# EAGLE design BB-Powersupply+KNX-Connection (EAGLE 9.6.2)
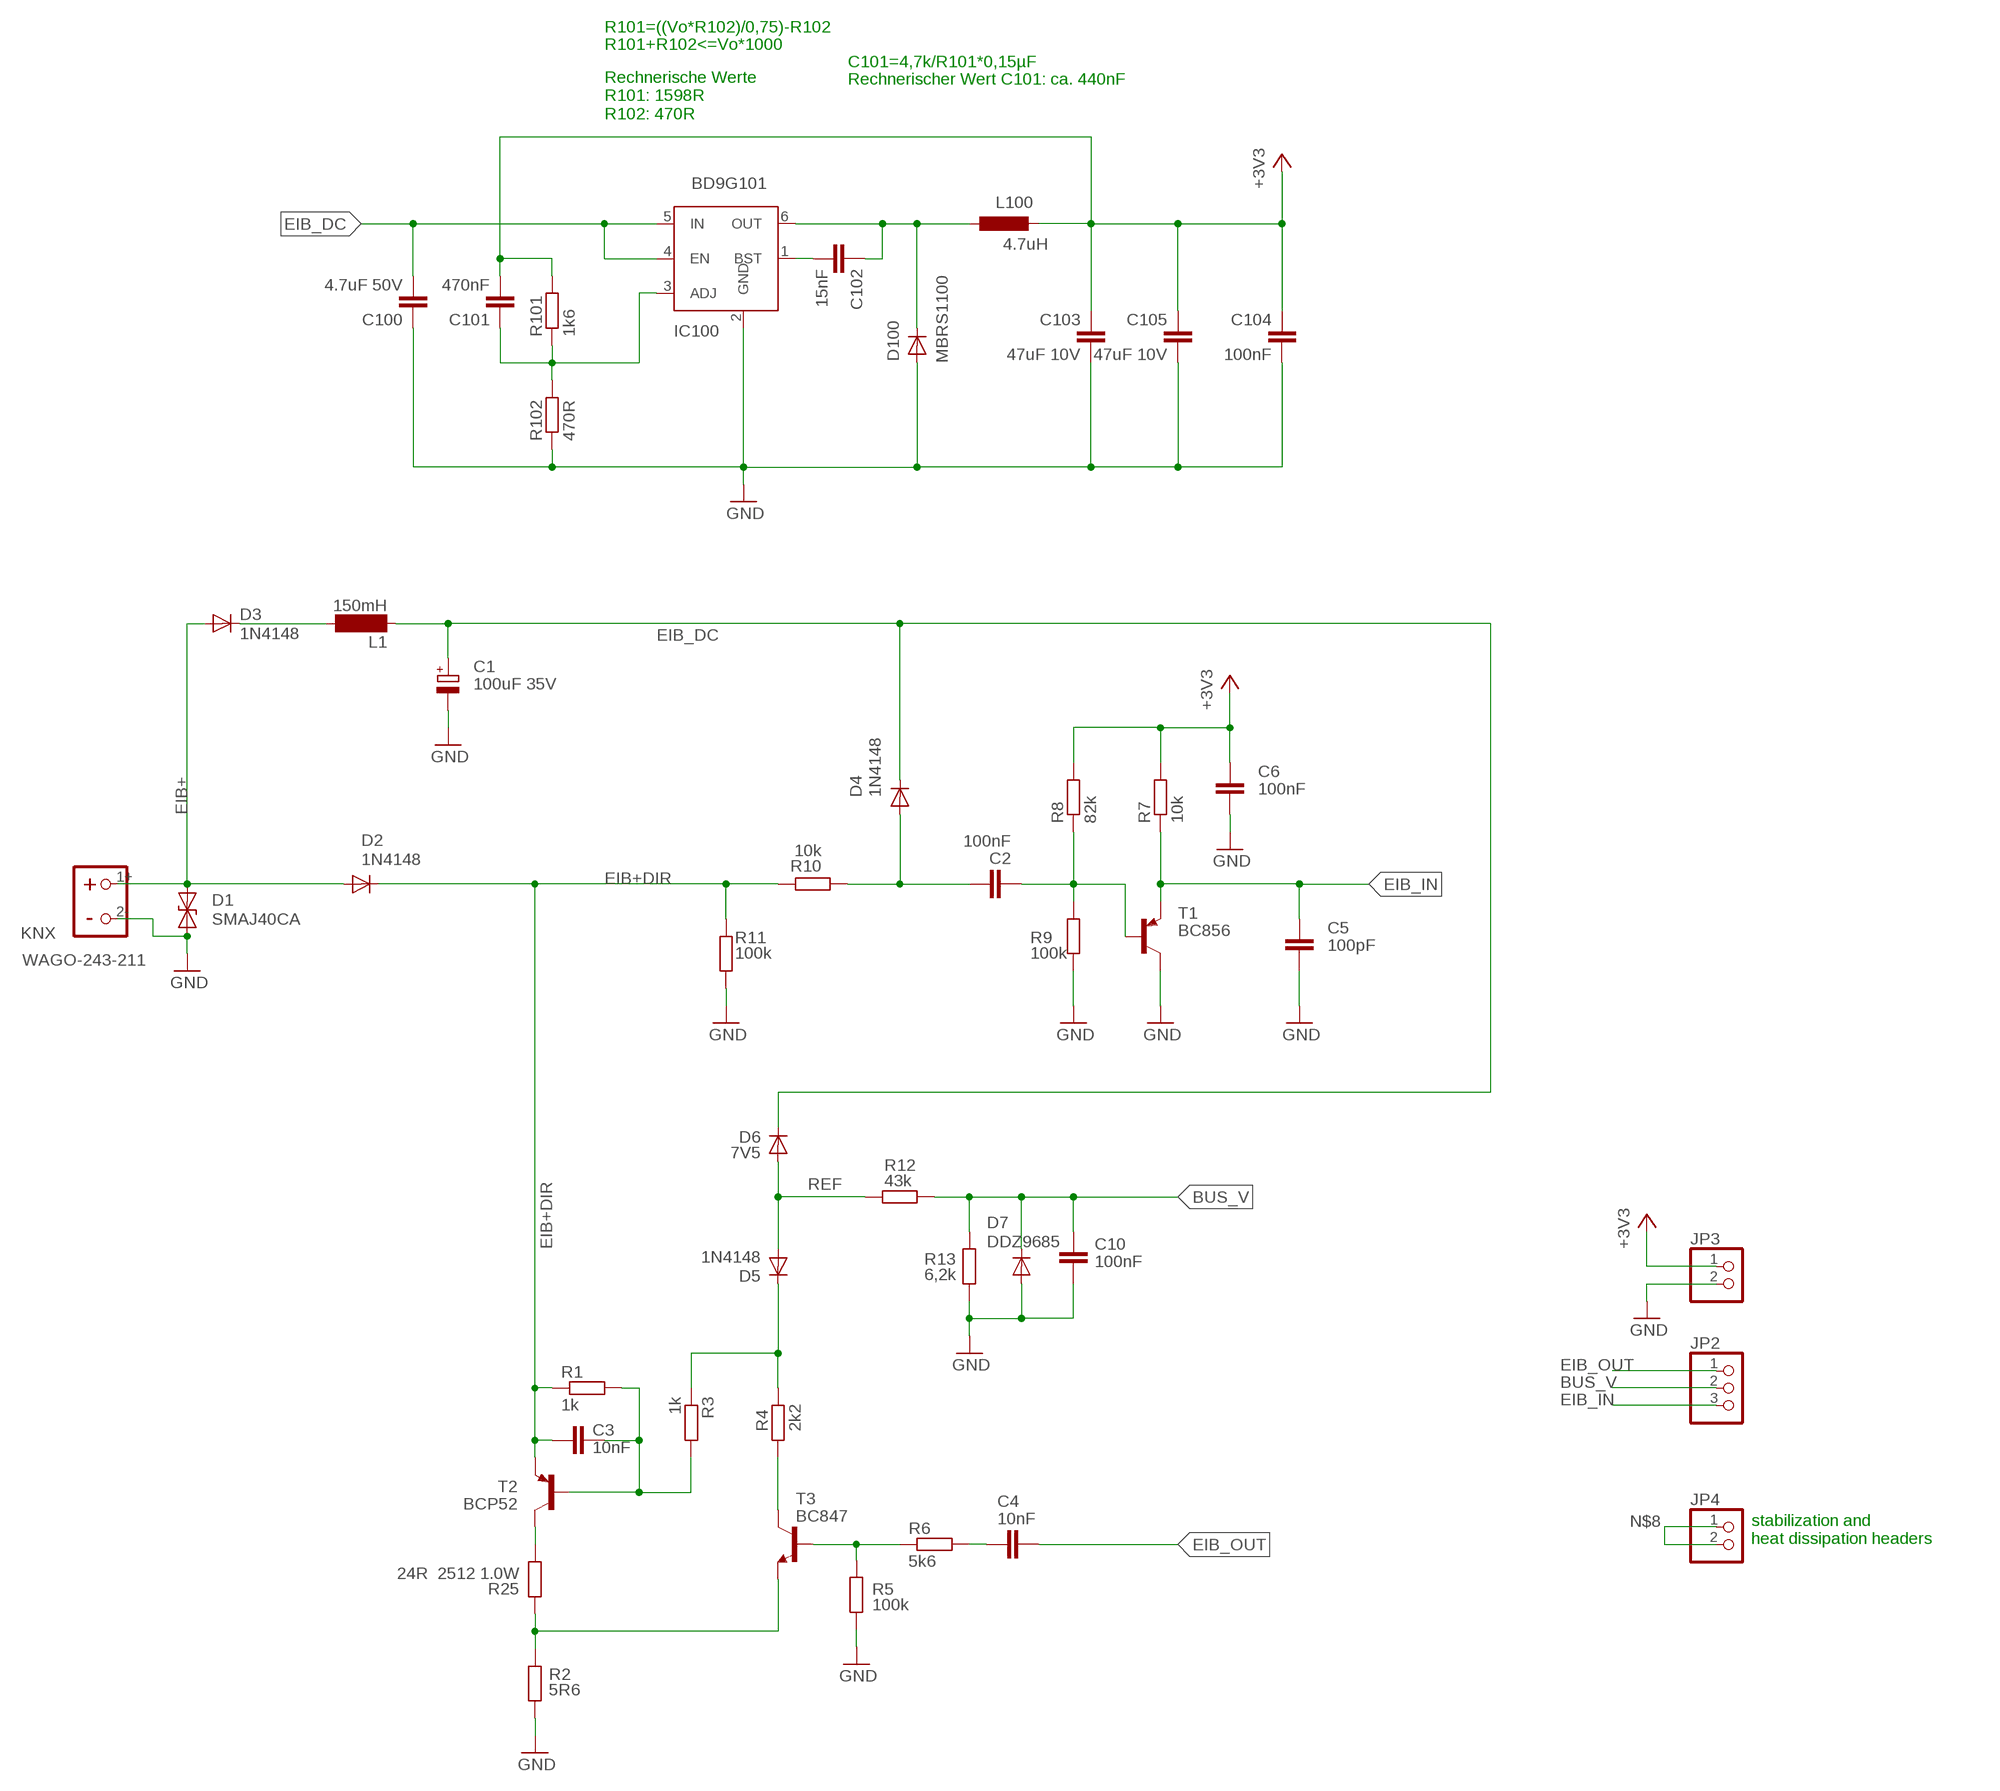
[diagram p0: schematic, sheet 1]

## Parts
C1  100uF 35V  CPOL-EUSANYO_SMD_C6  [SANYO-OSCON_SMD_C6]
C2  100nF  C-EUC0805  [C0805]
C3  10nF  C-EUC0805  [C0805]
C4  10nF  C-EUC0805  [C0805]
C5  100pF  C-EUC0805  [C0805]
C6  100nF  C-EUC0805  [C0805]
C10  100nF  C-EUC0805  [C0805]
C100  4.7uF 50V  C-EUC0805  [C0805]
C101  470nF  C-EUC0805  [C0805]
C102  15nF  C-EUC0805  [C0805]
C103  47uF 10V  C-EUC0805  [C0805]
C104  100nF  C-EUC0805  [C0805]
C105  47uF 10V  C-EUC0805  [C0805]
D1  SMAJ40CA  [DO214AC]
D2  1N4148  DIODESOD-123  [SOD-123]
D3  1N4148  DIODESOD-123  [SOD-123]
D4  1N4148  DIODESOD-123  [SOD-123]
D5  1N4148  DIODESOD-123  [SOD-123]
D6  7V5  DIODESOD-123  [SOD-123]
D7  DDZ9685  DIODESOD-123  [SOD-123]
D100  MBRS1100  DIODESOD-123  [SOD-123]
IC100  BD9G101  BD9G101GBD9G101G-SOT23-6  [SOT23-6]
JP2  PINHD-1X3  [1X03]
JP3  PINHD-1X2  [1X02]
JP4  PINHD-1X2  [1X02]
KNX  WAGO-243-211  [WAGO-243-211]
L1  150mH  BS11  [BS11]
L100  4.7uH  L-EUL4532P  [L4532P]
R1  1k  R-EU_R0805  [R0805]
R2  5R6  R-EU_R0805  [R0805]
R3  1k  R-EU_R0805  [R0805]
R4  2k2  R-EU_R0805  [R0805]
R5  100k  R-EU_R0805  [R0805]
R6  5k6  R-EU_R0805  [R0805]
R7  10k  R-EU_R0805  [R0805]
R8  82k  R-EU_R0805  [R0805]
R9  100k  R-EU_R0805  [R0805]
R10  10k  R-EU_R0805  [R0805]
R11  100k  R-EU_R0805  [R0805]
R12  43k  R-EU_R0805  [R0805]
R13  6,2k  R-EU_R0805  [R0805]
R25  24R 2512 1.0W  R-EU_R2512  [R2512]
R101  1k6  R-EU_R0805  [R0805]
R102  470R  R-EU_R0805  [R0805]
T1  BC856  BC856BSMD  [SOT23-BEC]
T2  BCP52  FZT753SMD  [SOT223]
T3  BC847  [SOT23]

## Nets
+3V3: C6.2 C101.2 C103.1 C104.1 C105.1 JP3.1 L100.2 R7.2 R8.2 R101.2
BST: C102.2 IC100.1(BST)
BUS_V: C10.2 D7.C JP2.2 R12.2 R13.1
EIB+: D1.C D2.A D3.A KNX.1+
EIB+DIR: C3.1 D2.C R1.1 R10.2 R11.2 T2.3(E)
EIB_DC: C1.+ C100.2 D4.C D6.C IC100.4(EN) IC100.5(IN) L1.1
EIB_IN: C5.2 JP2.3 R7.1 T1.E
EIB_OUT: C4.2 JP2.1
FB: C101.1 IC100.3(ADJ) R101.1 R102.2
GND: C1.- C5.1 C6.1 C10.1 C100.1 C103.2 C104.2 C105.2 D1.A D7.A D100.A IC100.2(GND) JP3.2 KNX.2- R2.1 R5.2 R9.1 R11.1 R13.2 R102.1 T1.C
LX: C102.1 D100.C IC100.6(OUT) L100.1
N$1: C2.2 D4.A R10.1
N$2: D3.C L1.2
N$3: C4.1 R6.2
N$6: R4.1 T3.3(C)
N$7: R2.2 R25.1 T3.2(E)
N$8: JP4.1 JP4.2 R25.2 T2.2(C) T2.4(C)
N$12: R5.1 R6.1 T3.1(B)
N$14: C2.1 R8.1 R9.2 T1.B
N$15: C3.2 R1.2 R3.2 T2.1(B)
N$25: D5.C R3.1 R4.2
REF: D5.A D6.A R12.1

## Notes on the sheet
- R101=((Vo*R102)/0,75)-R102
- R101+R102<=Vo*1000
- C101=4,7k/R101*0,15µF
- Rechnerischer Wert C101: ca. 440nF
- Rechnerische Werte 
  R101: 1598R
  R102: 470R
- stabilization and 
  heat dissipation headers

## Library data of the parts
C1 = rcl:CPOL-EU: POLARIZED CAPACITOR, European symbol; SPICEPREFIX: C
C2-C6 C10 C101 C103-C105 = rcl:C-EU: CAPACITOR, European symbol; SPICEPREFIX: C
C100 = rcl:C-EU: CAPACITOR, European symbol; REICHELT: X7R-G1206 4,7/50; SPICEPREFIX: C
C102 = rcl:C-EU: CAPACITOR, European symbol; REICHELT: X7R-G0805 15N; SPICEPREFIX: C
D1 = smaj_10:SMAJ*CA: SMAJ Series TVS Diodes Source: http://www.littelfuse.com/~/media/electronics/datasheets/tvs_diodes/littelfuse_tvs_diode_smaj_datasheet.pdf.pdf; MF: Littelfuse; MPN: SMAJ40CA; OC_FARNELL: 1827675; OC_NEWARK: 71J2019
D2-D7 D100 = microbuilder:DIODE: Diode SMA Model Volts Amps Type Vf Vr Digikey # Notes SSA34-E3 40V 3A Schottky 480mV @ 3A 200uA @ 40V SSA34-E3/61TGITR-ND CDBA120-G 20V 1A Schottky 500mV @ 1A 500uA @ 20V 641-1014-6-ND REEL MBRA210 10V 2A Schottky 350mV @ 2A 700uA @ 10V MBRA210LT3 SOD-123 Model Volts Amps Type Vf Vr Order # Notes BAT54T1G 30V 200mA Schottky 800mV @ 200mA 2uA @ 25V BAT54T1GOSTR-ND B0530W 30V 500mA Schottky 430mV @ 500mA 130uA @ 30V B0530W-FDICT-ND REEL MBR120 1A 20V Schottky 340mV @ 1A MBR120VLSFT1GOSCT-ND SOD-323 Model Volts Amps Type Vf Vr Order # Notes PMEG2005EJ 20V 500mA Schottky 355mV @ 500mA 568-4110-1-ND ZLLS410 10V 570mA Schottky 380mV @ 570mA ZLLS410CT-ND 1N4148WS 75V 150mA Silicon/Simple 1V 1N4148WSFSCT-ND REEL SOD-523 Model Volts Amps Type Vf Vr Order # Notes BAT54XV2 30V 200mA Schottky 0.8V @ 100mA BAT54XV2CT-ND TB751S 30V 30mA Schottky RB751S-40TE61CT-ND SOT23-R/W (R = Solder Paste/Reflow Ovens, W = Hand-Soldering) Model Volts Amps Type Vf Vr Order # Notes BAT54FILM 40V 300mA Schottky 497-7162-1-ND
IC100 = Stefan_selfbus:BD9G101G
JP2 = pinhead_dmx:PINHD-1X3: PIN HEADER
JP3 JP4 = pinhead_dmx:PINHD-1X2: PIN HEADER
KNX = Connector_for_Selfbus-Projects:WAGO-243-211: WAGO KNX-Busklemme
L1 = dmx_inductor-neosid:BS: INDUCTOR nominal inductance, magnetically screened; OC_FARNELL: unknown; OC_NEWARK: unknown; SPICEPREFIX: L
L100 = rcl_changed:L-EU: INDUCTOR, European symbol; SPICEPREFIX: L
R1-R5 R7-R13 R25 R101 R102 = rcl:R-EU_: RESISTOR, European symbol; SPICEPREFIX: R
R6 = rcl:R-EU_: RESISTOR, European symbol; REICHELT: SMD-0805 5,60K; SPICEPREFIX: R
T1 = transistor-pnp:BC856*: PNP Transistror
T2 = transistor-pnp:FZT753SMD: PNP Transistor
T3 = transistor:BC847: NPN TRANSISTOR; REICHELT: BC 847C SMD

## Board
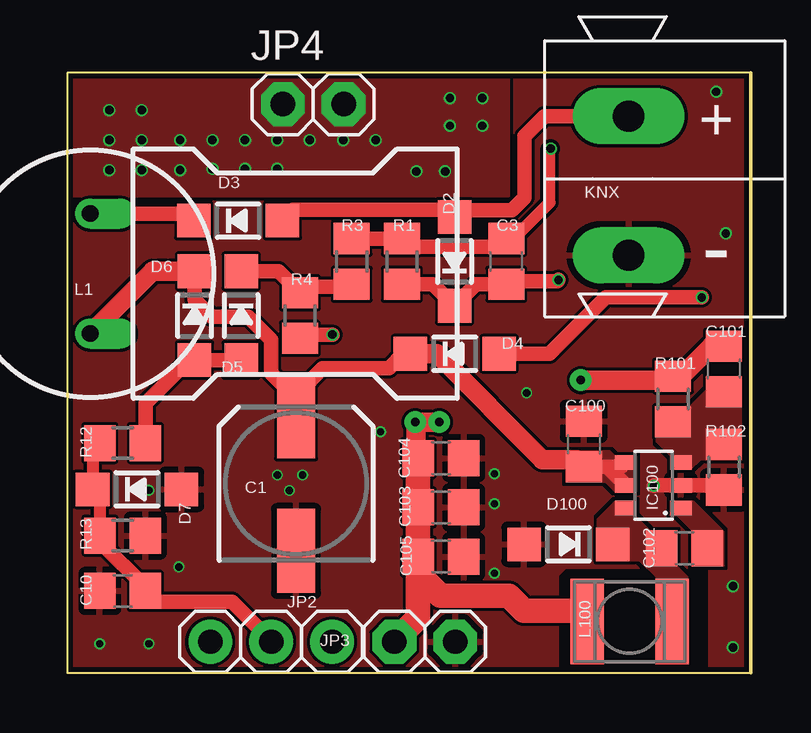
[diagram p1: board, top side]
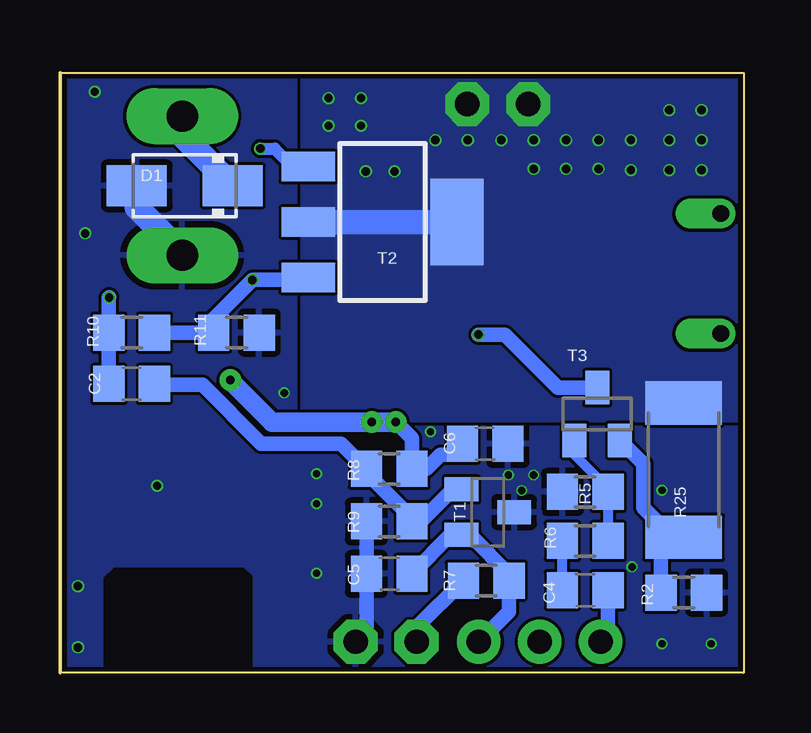
[diagram p2: board, bottom side, seen from below]

Size 28.5 x 25 mm. Coordinates in mm from the lower left corner, seen from the top.
Outline: 0,25 0,0 28.5,0 28.5,25 0,25
Copper layers (1*16): Top 0.035mm / dielectric 1.6mm / Bottom 0.035mm
Design rules "jlcpcb-2layers": minimum track width 5mil, minimum drill 0.3mm, track to track 5mil, track to pad 5mil, pad to pad 5mil, via to via 5mil, smd to smd 5mil, copper to edge 0.2mm, drill to drill 6mil, minimum pad ring 10mil, minimum via ring 3mil, stop-mask expansion 4mil, vias tented up to drill 0mil, thermal gap 10mil

### Footprints (pad centres in the part's own frame; a part is rotated, then mirrored left to right if it is on the bottom)
SANYO-OSCON_SMD_C6 = smd 3.5 x 1.6: + 2.8,0; - -2.8,0
C0805 = smd 1.3 x 1.5: 1 -0.95,0; 2 0.95,0
DO214AC = smd 2.5 x 1.7: A 2,0; C -2,0
SOD-123 = smd 1.4 x 1.4: A 1.85,0; C -1.85,0
SOT23-6 = smd 0.6 x 0.9: 1 -0.95,-1.15; 2 0,-1.15; 3 0.95,-1.15; 4 0.95,1.15; 5 0,1.15; 6 -0.95,1.15
1X03 = drill 1.016: 1 -2.54,0; 2 0,0; 3 2.54,0
1X02 = drill 1.016 pad 1.676 octagon: 1 -1.27,0; 2 1.27,0
WAGO-243-211 = drill 1.3 long: 1+ 0,2.65; 2- 0,-3.15
BS11 = drill 0.7 offset: 1 -2.5,0; 2 2.5,0
L4532P = smd 1.397 x 3.556: 1 -1.778,0; 2 1.778,0
R0805 = smd 1.3 x 1.5: 1 -0.95,0; 2 0.95,0
R2512 = smd 1.8 x 3.2: 1 -2.8,0; 2 2.8,0
SOT23-BEC = smd 1 x 1.4: B -0.95,-1.1; C 0,1.1; E 0.95,-1.1
SOT223 = smd 1.219 x 2.235: 1 -2.311,-3.099; 2 0,-3.099; 3 2.311,-3.099 | smd 3.6 x 2.2: 4 0,3.099
SOT23 = smd 1 x 1.4: 1 -0.95,-1.1; 2 0.95,-1.1; 3 0,1.1

### Placement (x,y rotation side)
C1  9.53,7.89 90 top
C2  25.51,12.05 180 bottom
C3  18.3,17.15 90 top
C4  6.6,3.45 0 bottom
C5  14.77,4.13 0 bottom
C6  10.78,9.55 180 bottom
C10  2.31,3.42 0 top
C100  21.53,9.54 270 top
C101  27.37,12.67 90 top
C102  25.72,5.2 0 top
C103  15.57,6.9 0 top
C104  15.57,8.95 0 top
C105  15.57,4.85 0 top
D1  23.3,20.3 180 bottom
D2  16.14,17.15 90 top
D3  7.12,18.85 0 top
D4  16.15,13.3 0 top
D5  7.25,14.89 270 top
D6  5.3,14.89 270 top
D7  2.91,7.65 0 top
D100  20.89,5.36 180 top
IC100  24.43,7.82 90 top
JP2  8.5,1.3 0 top
JP3  14.9,1.3 0 top
JP4  10.25,23.7 0 top
KNX  23.4,20.55 0 top
L1  0.95,16.64 90 top
L100  23.44,2.15 180 top
R1  13.95,17.15 90 top
R2  2.49,3.35 180 bottom
R3  11.85,17.15 90 top
R4  9.7,14.89 90 top
R5  6.6,7.55 180 bottom
R6  6.6,5.5 180 bottom
R7  10.72,3.85 180 bottom
R8  14.77,8.5 0 bottom
R9  14.77,6.32 0 bottom
R10  25.51,14.18 0 bottom
R11  21.14,14.18 180 bottom
R12  2.31,9.58 180 top
R13  2.31,5.72 0 top
R25  2.5,8.45 90 bottom
R101  25.25,11.42 90 top
R102  27.37,8.58 90 top
T1  10.66,6.7 270 bottom
T2  15.05,18.79 270 bottom
T3  6.1,10.79 0 bottom

### Tracks (layer width: path | path; a pad name or v marks a point on that pad's centre or on a via)
+3V3  (via drill 0.35 pad 0.9)
  Top 0.813: v21.4,12.2 24.79,12.2 24.96,12.37 R101.2 25.6,12.37 26.85,13.62 C101.2 | C104.1 14.52,9.05 14.52,10.43 v14.5,10.45 v15.5,10.45
  Top 1.016: L100.2 21.23,2.58 19.03,2.58 18.4,3.21 15.56,3.21 14.62,4.15 C105.1 | C105.1 14.62,2.29 JP3.1 | C105.1 C103.1 C104.1
  Bottom 0.61: R7.2 13.63,1.9 JP3.1 | C6.2 12.18,9.1 12.62,9.1 13.22,8.5 R8.2 13.82,9.78 v14.5,10.45
  Bottom 0.813: v21.4,12.2 19.65,10.45 v14.5,10.45
BST
  pour Top (no thermals): 25.15,7.15 26.1,7.15 27.35,5.9 27.35,4.45 26.05,4.45 26.05,5.95 25.45,6.55 25.15,6.55
BUS_V
  Top 0.508: R12.2 1.06,9.28 D7.C 1.36,7.35 R13.1
  Top 0.61: JP2.2 8.5,1.33 6.87,2.97 3.71,2.97 C10.2 3.26,3.57 1.36,5.47 R13.1
EIB+
  Top 0.61: D3.A 9.42,19.3 15.84,19.3 D2.A 16.19,19 16.47,19.28 18.53,19.28 19.05,19.8 19.05,22.35 19.9,23.2 KNX.1+
  Bottom 1.016: D1.C 23.4,22.4 KNX.1+
EIB+DIR  (via drill 0.35)
  Top 0.61: R1.1 15.24,16.2 D2.C 17.04,16.2 C3.1 18.43,16.33 20.42,16.33 v20.47,16.38
  Bottom 0.61: R10.2 24.49,14.11 24.23,14.18 R11.2 22.09,14.76 v20.47,16.38 18.25,16.38
  Bottom 0.813: 18.25,16.38 T2.3
EIB_DC
  Top 0.61: D6.C 5.3,15.55 6.01,14.84 7.54,14.84 8.48,13.89 8.48,12.49 9.53,11.44 C1.+ 9.73,10.89 9.73,11.79 10.64,12.7 13.4,12.7 14,13.3 D4.C | IC100.4 23.1,8.59 C100.2 22.51,8.59 IC100.5
  Top 0.813: D6.C 3.55,16.74 L1.1 | C100.2 21.23,8.89 19.81,8.89 15.4,13.3 D4.C
  pour Top (no thermals): 20.8,9.25 22.6,9.25 22.8,9.05 23.7,9.05 23.7,7.55 22.85,7.55 22.45,7.95 20.8,7.95
EIB_IN
  Bottom 0.61: JP2.3 9.79,2.55 9.79,3.83 R7.1 9.72,3.9 9.72,4.06 11.41,5.75 T1.E 12.21,5.75 C5.2
EIB_OUT
  Bottom 0.61: C4.2 5.65,1.61 JP2.1
FB
  pour Top (no thermals): 26.65,11.8 25.9,11.05 24.55,11.05 24.55,9.65 25.15,9.05 25.15,8.5 26,8.5 26.4,8.9 28.1,8.9 28.1,12.3 26.65,12.3
GND  (via drill 0.3, 0.35)
  Top 0.61: v24.45,7.8 24.47,7.82 IC100.2 27.18,7.82 R102.1
  Bottom 0.61: JP3.2 15.73,1.75 C5.1 R9.1
  Bottom 1.016: D1.A 25.3,19.4 23.4,17.5 KNX.2-
  other vias: 27.75,3.62 3.4,7.62 27.75,1.07 19.15,11.67 27.45,18.32 27.05,24.22 3.4,1.22 1.35,1.22 8.75,8.25 9.8,8.25 9.25,7.6 13.05,10.05 4.65,4.42 17.8,4.15 17.8,7.05 17.8,8.3
  pour Top (rank 4): 28.5,25 0,25 0,0 28.5,0
  pour Bottom (rank 3): 28.5,25 0,25 0,0 28.5,0
LX
  pour Top (no thermals): 22.85,7.15 22.1,6.4 22.1,4.7 23.85,4.7 24.55,4 24.55,0.4 25.9,0.4 25.9,3.95 25.4,4.45 25.4,5.9 24.3,5.9 23.7,6.5 23.7,7.15
N$1  (via drill 0.35)
  Top 0.61: D4.A 20.1,13.3 22.45,15.65 v26.45,15.65
  Bottom 0.61: R10.1 | R10.1 C2.2 | v26.45,15.65 26.46,15.64 R10.1
N$2
  Top 0.61: D3.C 4.98,19.14 L1.2
N$3
  Bottom 0.406: C4.1 R6.2
N$6  (via drill 0.35)
  Top 0.61: v11.05,14.1 9.86,14.1 R4.1
  Bottom 0.61: v11.05,14.1 9.95,14.1 7.74,11.89 T3.3
N$7
  Bottom 0.61: T3.2 4.18,8.72 4.18,6.89 2.95,5.65 | R25.1 2.95,5.65 | R2.2 3.44,5.16 2.95,5.65
N$8  (via drill 0.35)
  Bottom 1.016: T2.4 T2.2
  other vias: 1.75,23.45 1.75,22.2 1.75,20.95 3.1,23.45 3.1,22.2 3.1,20.95 4.7,22.2 4.7,20.95 6.05,22.2 6.05,21 15.95,23.95 15.95,22.8 17.3,23.95 17.3,22.8 12.85,22.2 10.1,22.2 11.5,22.2 7.4,22.2 7.4,21 8.75,22.2 8.75,21 14.55,20.9 15.75,20.9
  pour Bottom (no thermals): 0,25.05 18.4,25.05 18.4,10.5 0,10.5
  pour Top (no thermals): 0,25.05 18.4,25.05 18.4,19.85 0,19.85
N$12
  Bottom 0.406: T3.1 7.05,9.1 5.65,7.7 R5.1 R6.1
N$14
  Bottom 0.61: C2.1 24.51,12 22.56,12 20.11,9.55 16.77,9.55 R8.1 15.73,8.35 13.82,6.45 R9.2 13.44,6.32 12.11,7.65 T1.B
N$15  (via drill 0.35)
  Top 0.508: C3.2 18.6,18.1 20.1,19.6 20.1,21.8 v20.15,21.85
  Top 0.61: R3.2 R1.2 14.3,17.75 17.95,17.75 C3.2
  Bottom 0.508: v20.15,21.85 19.55,21.85 18.8,21.1 T2.1
N$25
  Top 0.61: R3.1 11.75,16.1 9.96,16.1 R4.2 8.81,16.73 D5.C
NOGND
  cutout Top (rank 3): 24.45,0 20.55,0 20.55,4.05 20.8,4.3 24.05,4.3 24.45,3.9
NOGND1
  cutout Bottom (rank 3): 26.65,0 20.5,0 20.5,4 20.85,4.35 26.25,4.35 26.65,3.95
NOGND2
  cutout Top (rank 3): 26.65,0 25.95,0 25.95,4.25 26.65,4.25
REF
  Top 0.61: D5.A D6.A 5.07,13.04 3.26,11.23 R12.1

### Text on the board
bDocu: Selfbus Power and / KNX-Connection / Board v0.9.2